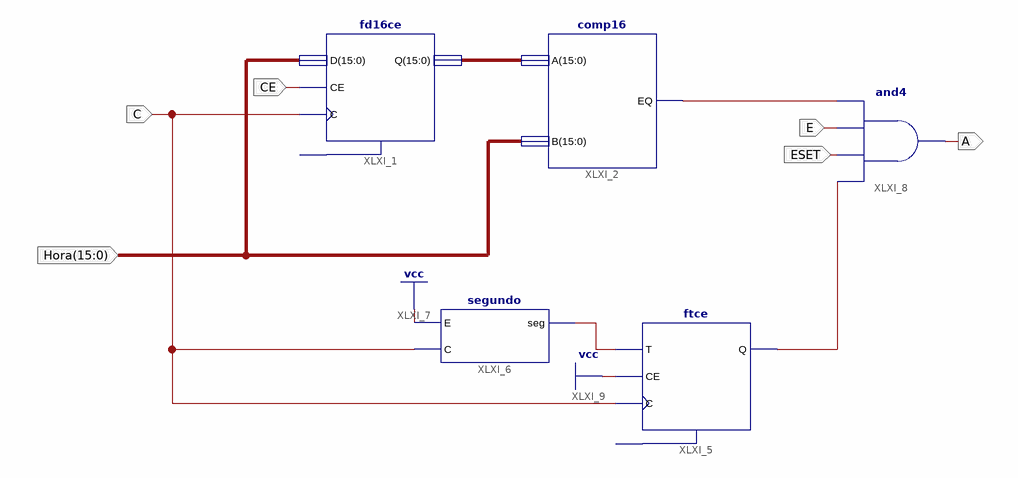
[diagram p0: schematic sheet 1]
// Xilinx ISE schematic Alarma.sch (spartan3e) as structural Verilog: 5 symbols, 6 ports
module Alarma (
  input  [15:0] Hora,
  input  C,
  input  CE,
  input  E,
  input  ESET,
  output A
);

  wire L, XLXN_10, XLXN_17;
  wire [15:0] XLXN_2;

  fd16ce XLXI_1 (.C(C), .CE(CE), .D(Hora), .Q(XLXN_2));  // open: CLR
  comp16 XLXI_2 (.A(XLXN_2), .B(Hora), .EQ(L));
  ftce XLXI_5 (.C(C), .CE(1'b1), .T(XLXN_10), .Q(XLXN_17));  // open: CLR
  segundo XLXI_6 (.C(C), .E(1'b1), .seg(XLXN_10));
  and XLXI_8 (A, XLXN_17, ESET, E, L);
endmodule
